# Altium schematic sheet I2C Network.SchDoc: I2C Network
size 292 x 193 mm; SheetNumber: 6; SheetTotal: 22
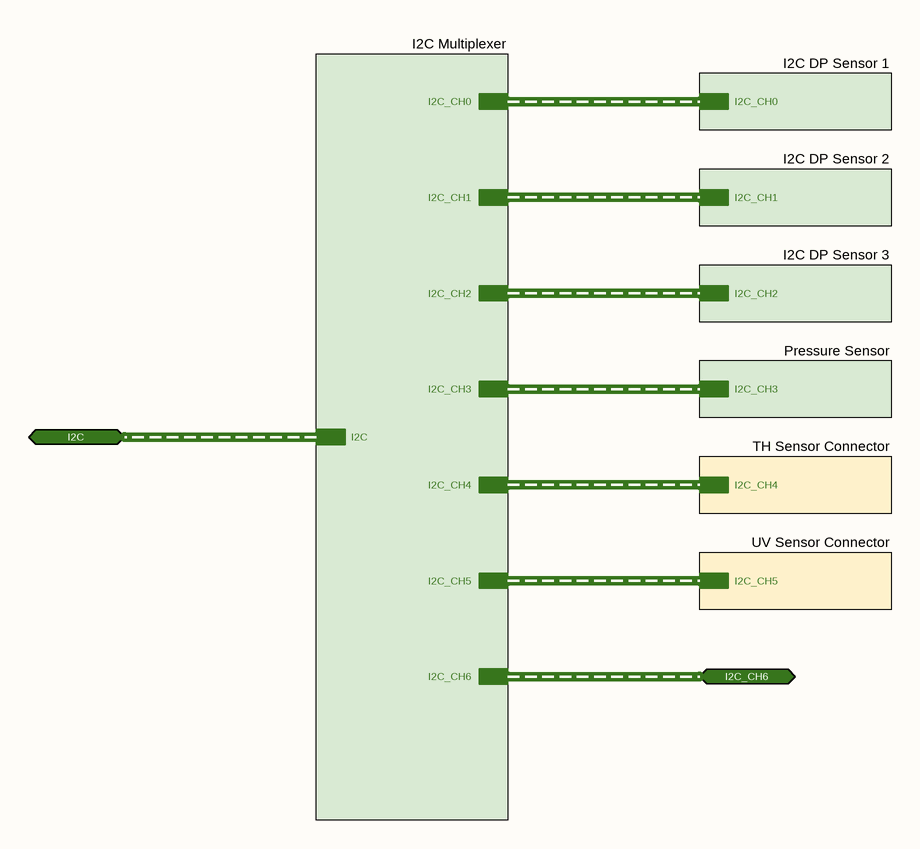
[diagram p0: I2C Network.SchDoc]

## Sub-sheets
I2C DP Sensor 1 = I2C DP Sensor 1.SchDoc: I2C_CH0 (harness I2C_CH0)
I2C DP Sensor 2 = I2C DP Sensor 2.SchDoc: I2C_CH1 (harness I2C_CH1)
I2C DP Sensor 3 = I2C DP Sensor 3.SchDoc: I2C_CH2 (harness I2C_CH2)
I2C Multiplexer = I2C Multiplexer.SchDoc: I2C_CH3 (harness I2C_CH3), I2C_CH6 (harness I2C_CH6), I2C_CH5 (harness I2C_CH5), I2C (harness I2C), I2C_CH1 (harness I2C_CH1), I2C_CH2 (harness I2C_CH2), I2C_CH0 (harness I2C_CH0), I2C_CH4 (harness I2C_CH4)
Pressure Sensor = I2C P Sensor.SchDoc: I2C_CH3 (harness I2C_CH3)
TH Sensor Connector = I2C TH Sensor Socket.SchDoc: I2C_CH4 (harness I2C_CH4)
UV Sensor Connector = I2C UV Sensor.SchDoc: I2C_CH5 (harness I2C_CH5)

## Ports
I2C (bidir, harness I2C), I2C_CH6 (bidir, harness I2C_CH6)

## Buses and harness runs
harness port I2C = sheet I2C Multiplexer/I2C
harness port I2C_CH6 = sheet I2C Multiplexer/I2C_CH6
harness sheet I2C DP Sensor 1/I2C_CH0 = sheet I2C Multiplexer/I2C_CH0
harness sheet I2C DP Sensor 2/I2C_CH1 = sheet I2C Multiplexer/I2C_CH1
harness sheet I2C DP Sensor 3/I2C_CH2 = sheet I2C Multiplexer/I2C_CH2
harness sheet I2C Multiplexer/I2C_CH3 = sheet Pressure Sensor/I2C_CH3
harness sheet I2C Multiplexer/I2C_CH4 = sheet TH Sensor Connector/I2C_CH4
harness sheet I2C Multiplexer/I2C_CH5 = sheet UV Sensor Connector/I2C_CH5

## Notes on the sheet
- © 2021 All rights reserved.
  This document may not, in whole or in part, be copied, photocopied, reproduced, translated or converted to any electronic or machine readable from without prior written permission of Mehmet Günce Akkoyun.
  Engineer contact : akkoyun@me.com
- Property of
- Engineer :
- Date :
- Size :
- A4
- Time :
- Project :
- Page :
- /
- Customer :
- Product ID :
- Module ID :
- Version :
- File :
- Revision :